# EAGLE design ComboBreaker (EAGLE 8.0.2)
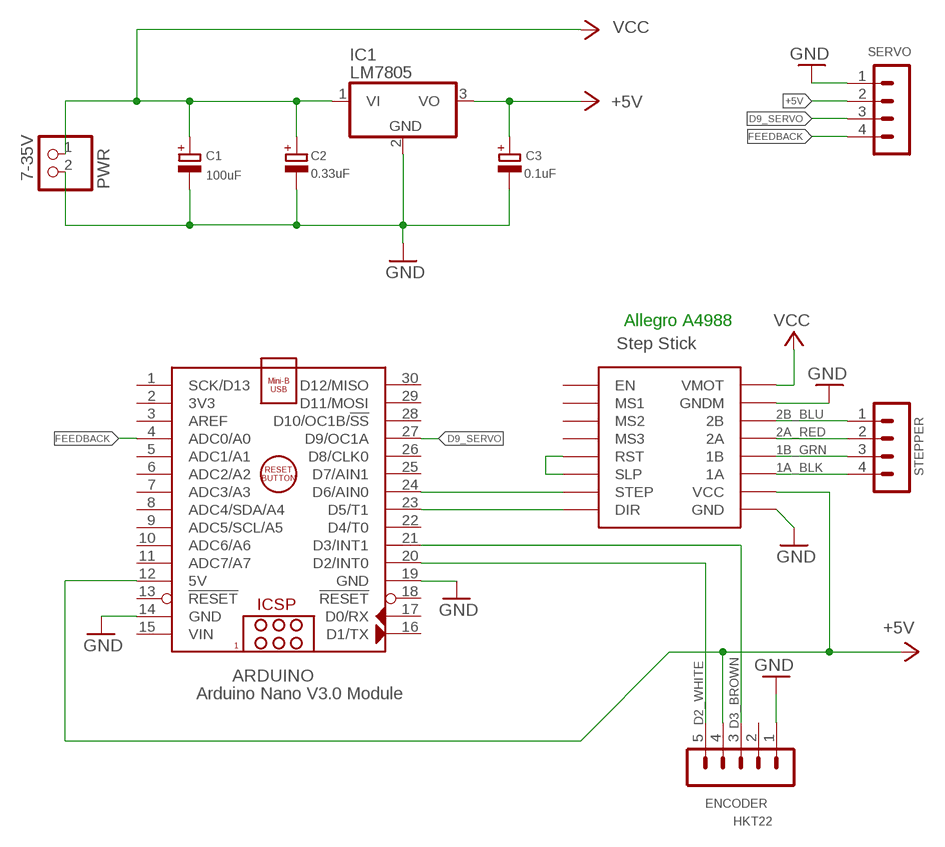
[diagram p0: schematic, sheet 1]

## Parts
ARDUINO  Arduino Nano V3.0 Module  ARDUINO_NANO  [ARDUINO_NANO]
C1  100uF  CPOL-EUE2-4  [E2-4]
C2  0.33uF  CPOL-EUE2-4  [E2-4]
C3  0.1uF  CPOL-EUE2-4  [E2-4]
ENCODER  HKT22  MA05-1  [MA05-1]
IC1  LM7805  7805TV  [TO220V]
PWR  7-35V  JST_2PIN-SMT  [JST-PH-2-SMT]
SERVO  MA04-1  [MA04-1]
STEPPER  MA04-1  [MA04-1]
U$2  Allegro A4988  STEP-STICK  [STEP-STICK]

## Nets
1A_BLK: STEPPER.4 U$2.1A
1B_GRN: STEPPER.3 U$2.1B
2A_RED: STEPPER.2 U$2.2A
2B_BLU: STEPPER.1 U$2.2B
+5V: ARDUINO.12(5V) C3.+ ENCODER.4 IC1.3(VO) SERVO.2 U$2.VCC
D2_WHITE: ARDUINO.20(D2/INT0) ENCODER.5
D3_BROWN: ARDUINO.21(D3/INT1) ENCODER.3
D9_SERVO: ARDUINO.27(D9/OC1A) SERVO.3
DIR: ARDUINO.23(D5/T1) U$2.DIR
FEEDBACK: ARDUINO.4(ADC0/A0) SERVO.4
GND: ARDUINO.14(GND) ARDUINO.19(GND) C1.- C2.- C3.- ENCODER.1 IC1.2(GND) PWR.2 SERVO.1 U$2.GND U$2.GNDM
RST_SLP: U$2.RST U$2.SLP
STEP: ARDUINO.24(D6/AIN0) U$2.SPT(STEP)
VCC: C1.+ C2.+ IC1.1(VI) PWR.1 U$2.VMOT
Unconnected: ARDUINO.1(SCK/D13) ARDUINO.2(3V3) ARDUINO.3(AREF) ARDUINO.5(ADC1/A1) ARDUINO.6(ADC2/A2) ARDUINO.7(ADC3/A3) ARDUINO.8(ADC4/SDA/A4) ARDUINO.9(ADC5/SCL/A5) ARDUINO.10(ADC6/A6) ARDUINO.11(ADC7/A7) ARDUINO.13(!RESET) ARDUINO.16(D1/TX) ARDUINO.17(D0/RX) ARDUINO.18(!RESET) ARDUINO.22(D4/T0) ARDUINO.25(D7/AIN1) ARDUINO.26(D8/CLK0) ARDUINO.28(D10/OC1B/!SS) ARDUINO.29(D11/MOSI) ARDUINO.30(D12/MISO) ENCODER.2 U$2.EN U$2.MS1 U$2.MS2 U$2.MS3

## Notes on the sheet
- Allegro A4988

## Power pins joined to a net without a drawn wire
VIN: ARDUINO.15(VIN)

## Library data of the parts
ARDUINO = ArduinoNanoV30:ARDUINO_NANO: Arduino Nano V3.0 Module Overview: The Arduino Nano is a small, complete, and breadboard-friendly board based on the ATmega328 (Arduino Nano 3.x) or ATmega168 (Arduino Nano 2.x). It has more or less the same functionality of the Arduino Duemilanove, but in a different package. It lacks only a DC power jack, and works with a Mini-B USB cable instead of a standard one. The Nano was designed and is being produced by Gravitech <http://www.gravitech.us/arna30wiatp.html>. General specifications: Item Value Microcontroller Atmel ATmega168 or ATmega328 Operating Voltage (logic level) 5 V Input Voltage (recommended) 7-12 V Input Voltage (limits) 6-20 V Digital I/O Pins 14 (of which 6 provide PWM output) Analog Input Pins 8 DC Current per I/O Pin 40 mA Flash Memory 16 KB (ATmega168) or 32 KB (ATmega328) of which 2 KB used by bootloader SRAM 1 KB (ATmega168) or 2 KB (ATmega328) EEPROM 512 bytes (ATmega168) or 1 KB (ATmega328) Clock Speed 16 MHz Dimensions (Inches) 0.73" x 1.70" Dimensions (mm) 18mm x 45mm Overall height About 9 mm (not including pins) Weigth 5 g Power: The Arduino Nano can be powered via the Mini-B USB connection, 6-20V unregulated external power supply (pin 30), or 5V regulated external power supply (pin 27). The power source is automatically selected to the highest voltage source. Memory: The ATmega168 has 16 KB of flash memory for storing code (of which 2 KB is used for the bootloader); the ATmega328 has 32 KB, (also with 2 KB used for the bootloader). The ATmega168 has 1 KB of SRAM and 512 bytes of EEPROM (which can be read and written with the EEPROM library); the ATmega328 has 2 KB of SRAM and 1 KB of EEPROM. Input and Output: Each of the 14 digital pins on the Nano can be used as an input or output, using pinMode(), digitalWrite(), and digitalRead() functions. They operate at 5 volts. Each pin can provide or receive a maximum of 40 mA and has an internal pull-up resistor (disconnected by default) of 20-50 kOhms. In addition, some pins have specialized functions. Visit Arduino - ArduinoBoardNano <https://www.arduino.cc/en/Main/ArduinoBoardNano>
C1-C3 = resistor:CPOL-EU: POLARIZED CAPACITOR, European symbol
ENCODER = con-lstb:MA05-1: PIN HEADER; OC_FARNELL: unknown; OC_NEWARK: unknown
IC1 = linear:78*: Positive VOLTAGE REGULATOR Source: http://cache.national.com/ds/LM/LM78L05.pdf http://www.fairchildsemi.com/ds/LM/LM7805.pdf
PWR = adafruit:JST_2PIN: JST 2-Pin Connectors of various flavors SMT-RA (S2B-PH-SM4) 4UConnector #17311 SMT (B2B-PH-SM4) THM-RA (S2B-PH) THM (B2B-PH)
SERVO STEPPER = con-lstb:MA04-1: PIN HEADER; OC_FARNELL: unknown; OC_NEWARK: unknown
U$2 = Arduino-clone:STEP-STICK

## Board
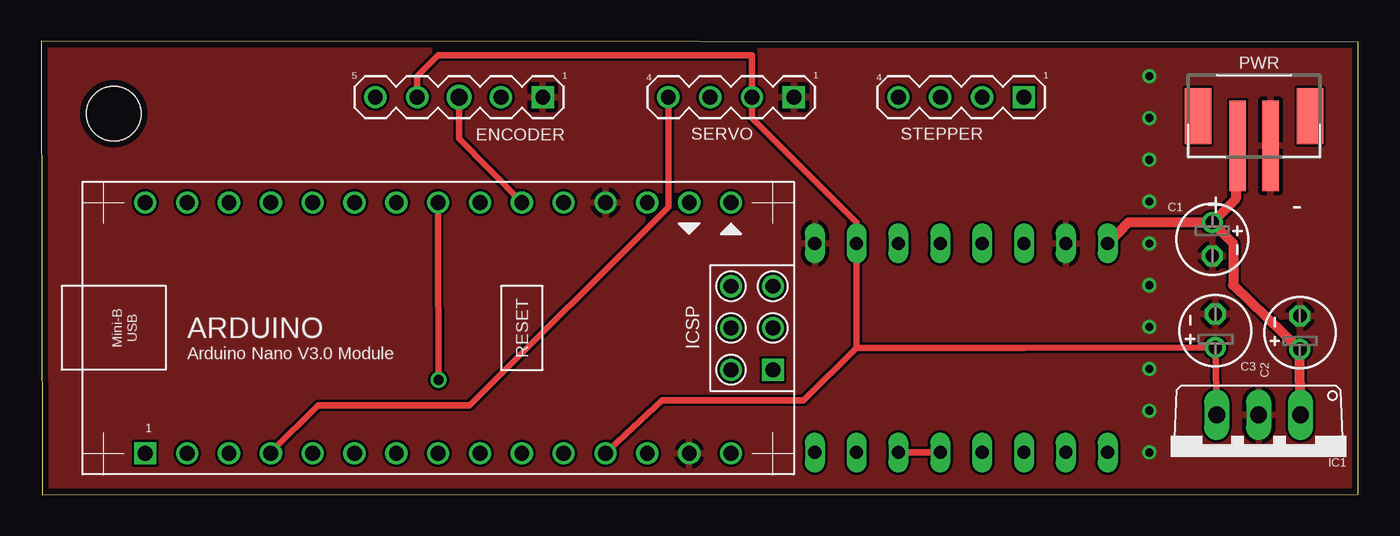
[diagram p1: board, top side]
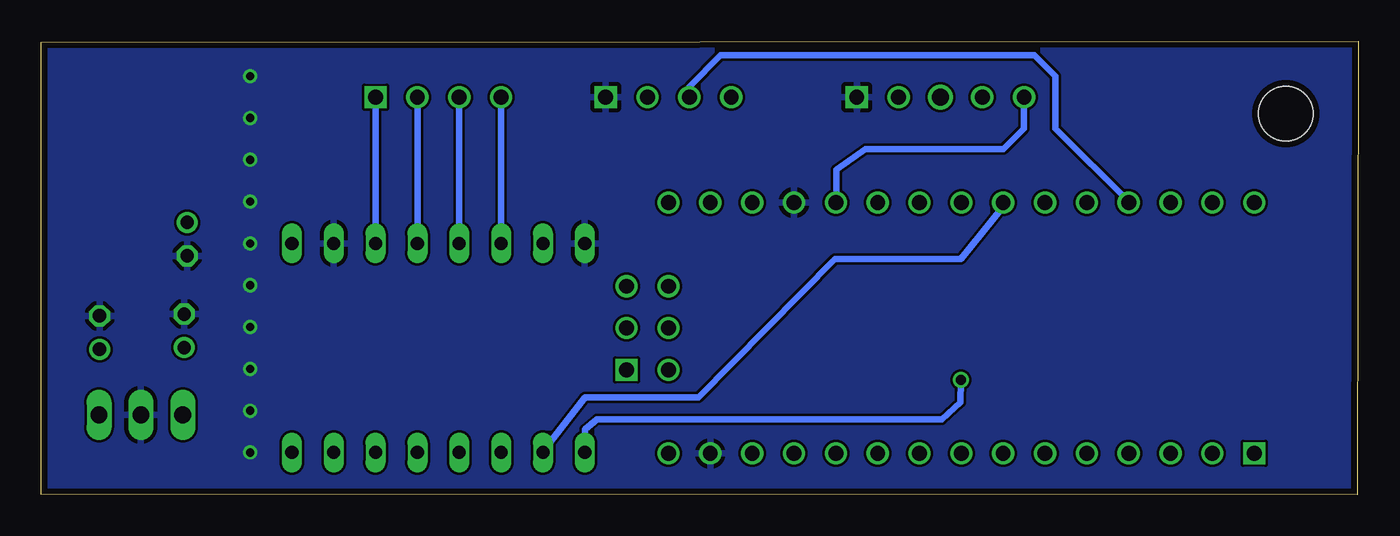
[diagram p2: board, bottom side, seen from below]

Size 79.96 x 27.55 mm. Coordinates in mm from the lower left corner, seen from the top.
Outline: 0.06,0 79.96,0.03 79.96,27.5 0,27.55 0.06,0
Copper layers (1*16): Top 0.0356mm / dielectric 1.5011mm / Bottom 0.0356mm
Design rules "LaenPCBOrder": minimum track width 6mil, minimum drill 13mil, track to track 6mil, track to pad 6mil, pad to pad 6mil, via to via 6mil, smd to smd 6mil, copper to edge 15mil, drill to drill 6mil, minimum pad ring 7mil, minimum via ring 7mil, stop-mask expansion 3mil, vias tented up to drill 0mil, thermal gap 10mil

### Footprints (pad centres in the part's own frame; a part is rotated, then mirrored left to right if it is on the bottom)
ARDUINO_NANO = drill 0.9 square: 1 -13.97,-7.62; 36 24.13,-2.54 | drill 0.9: 2 -11.43,-7.62; 3 -8.89,-7.62; 4 -6.35,-7.62; 5 -3.81,-7.62; 6 -1.27,-7.62; 7 1.27,-7.62; 8 3.81,-7.62; 9 6.35,-7.62; 10 8.89,-7.62; 11 11.43,-7.62; 12 13.97,-7.62; 13 16.51,-7.62; 14 19.05,-7.62; 15 21.59,-7.62; 16 21.59,7.62; 17 19.05,7.62; 18 16.51,7.62; 19 13.97,7.62; 20 11.43,7.62; 21 8.89,7.62; 22 6.35,7.62; 23 3.81,7.62; 24 1.27,7.62; 25 -1.27,7.62; 26 -3.81,7.62; 27 -6.35,7.62; 28 -8.89,7.62; 29 -11.43,7.62; 30 -13.97,7.62; 31 21.59,-2.54; 32 21.59,0; 33 21.59,2.54; 34 24.13,2.54; 35 24.13,0
E2-4 = drill 0.813 pad 1.27: + -1.016,0 | drill 0.813 pad 1.27 octagon: - 1.016,0
MA05-1 = drill 0.9 square: 1 -5.08,0 | drill 0.9: 2 -2.54,0; 4 2.54,0; 5 5.08,0 | drill 1.016: 3 0,0
TO220V = drill 1.016 long: 1 -2.54,-2.54; 2 0,-2.54; 3 2.54,-2.54
JST-PH-2-SMT = smd 1 x 5.5: 1 -1,-1.8; 2 1,-1.8 | smd 1.6 x 3.4: NC1 -3.4,0; NC2 3.4,0
MA04-1 = drill 0.9 square: 1 -3.81,0 | drill 0.9: 2 -1.27,0; 3 1.27,0; 4 3.81,0
STEP-STICK = drill 0.8 long: 1A -8.89,-7.62; 1B -8.89,-5.08; 2A -8.89,-2.54; 2B -8.89,0; DIR 3.81,-12.7; EN 3.81,5.08; GND -8.89,-12.7; GNDM -8.89,2.54; MS1 3.81,2.54; MS2 3.81,0; MS3 3.81,-2.54; RST 3.81,-5.08; SLP 3.81,-7.62; SPT 3.81,-10.16; VCC -8.89,-10.16; VMOT -8.89,5.08
STAND-OFF = hole 3.302: 0,0

### Placement (x,y rotation side)
ARDUINO  20.29,10.13 0 top
C1  71.1,15.52 270 top
C2  76.42,9.85 90 top
C3  71.28,9.96 90 top
ENCODER  25.37,24.16 180 top
IC1  73.91,2.31 180 top
PWR  73.63,23 0 top
SERVO  41.88,24.16 180 top
STEPPER  55.85,24.16 180 top
U$2  59.66,6.38 270 top
U$3  [STAND-OFF]  4.4,23.14 0 top

### Tracks (layer width: path | path; a pad name or v marks a point on that pad's centre or on a via)
1A_BLK
  Bottom 0.406: STEPPER.4 U$2.1A
1B_GRN
  Bottom 0.406: STEPPER.3 U$2.1B
2A_RED
  Bottom 0.406: STEPPER.2 U$2.2A
2B_BLU
  Bottom 0.406: STEPPER.1 U$2.2B
+5V
  Top 0.152: 34.29,2.54 34.26,2.57 ARDUINO.12 | U$2.VCC 49.5,14.63 49.49,14.63
  Top 0.406: 34.28,2.53 34.29,2.54 34.53,2.78 37.7,5.74 46.28,5.74 49.49,8.91 | 49.49,14.7 49.49,14.63 49.49,8.91 | 49.49,8.91 59.66,8.92 C3.+ IC1.3 | U$2.VCC 49.5,16.54 43.15,22.89 SERVO.2 43.15,26.7 24.1,26.7 22.83,25.43 ENCODER.4
D2_WHITE
  Bottom 0.152: ARDUINO.20 31.72,17.81 31.69,17.81
  Bottom 0.406: 31.69,17.74 31.69,17.81 31.69,19.74 29.93,21 21.56,20.98 20.29,22.25 ENCODER.5
D3_BROWN
  Top 0.152: ARDUINO.21 29.18,17.81 29.15,17.78
  Top 0.406: ENCODER.3 25.37,21.64 29.15,17.78 ARDUINO.21
D9_SERVO
  Bottom 0.152: 13.94,17.81 ARDUINO.27
  Bottom 0.406: 13.94,17.81 18.39,22.25 18.39,25.43 19.66,26.7 38.71,26.7 40.61,24.79 SERVO.3
DIR  (via drill 0.61)
  Top 0.406: v24.12,6.98 24.11,15.78 ARDUINO.23
  Bottom 0.254: 24.12,6.91 v24.12,6.98
  Bottom 0.406: 24.12,6.91 24.16,5.62 25.28,4.57 46.21,4.57 46.94,3.98 U$2.DIR
FEEDBACK
  Top 0.152: 13.94,2.57 ARDUINO.4
  Top 0.406: 13.94,2.57 16.8,5.43 26.01,5.43 38.07,17.49 SERVO.4
GND  (via drill 0.5)
  other vias: 67.28,25.43 67.28,22.89 67.28,20.35 67.28,17.81 67.28,15.27 67.28,12.73 67.28,10.19 67.28,7.65 67.28,5.11 67.28,2.57
  pour Bottom: -0.03,-0.06 79.98,0.03 80.04,27.63 0.1,27.52
  pour Top: 0,27.66 79.98,27.66 79.98,0.03 0,0.03
RST_SLP
  Top 0.406: U$2.RST U$2.SLP
STEP
  Bottom 0.152: U$2.SPT 49.5,2.62 | 21.56,17.49 21.59,17.49 | ARDUINO.24 21.56,17.81 21.59,17.72
  Bottom 0.406: 21.59,17.72 21.59,17.49 24.13,14.34 31.78,14.34 40.07,5.93 46.96,5.93 49.5,2.62
VCC
  Top 0.152: U$2.VMOT 64.77,15.24 | 72.52,21.14 PWR.1
  Top 0.406: 66.01,16.54 | 64.77,15.24 64.71,15.18
  Top 0.61: C1.+ 66.01,16.54 | 66.01,16.54 64.77,15.24 | 72.52,21.14 72.52,17.97 C1.+ | C1.+ 72.36,15.27 72.36,12.73 C2.+ IC1.1